# Altium schematic sheet LED.SchDoc
size A4
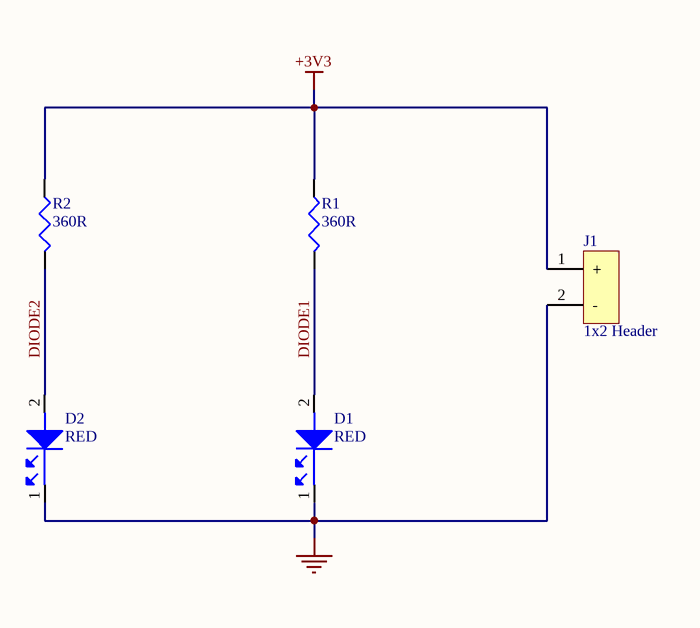
[diagram p0: LED.SchDoc]

## Parts
D1  RED  [LED0803RED]
D2  RED  [LED0803RED]
J1  1x2 Header  [HDR1X2]
R1  360R  [R0805]
R2  360R  [R0805]

## Nets
+3V3: J1.1(+) R1.1 R2.1
GND: D1.1(RED) D2.1(RED) J1.2(-)
DIODE1: D1.2 R1.2
DIODE2: D2.2 R2.2

## Library data of the parts
D1 D2 = LSL29K-G1J2-1-Z: LED Uni-Color Red 643nm Automotive 2-Pin SMD T/R; Manufacturer: Osram Opto; Lens Color: White; Lens Style: Flat,Diffused,Colorless,Rectangular; Viewing Angle: 160°; Forward Current: 20mA; Forward Voltage: 1.8V; Luminous Intensity: 4.5mcd; Test Current: 2mA; Dominant Wavelength: 630nm; Luminous Flux: 0.017lm; Number of LEDs: 1; Reverse Voltage: 12V; Lens Transparency: Diffused; Lens Size: 0.8mm; Supplier 1: Digi-Key; Supplier Part Number 1: 475-2506-1-ND; RoHS: Yes; Category: Optoelectronics; Stock 1: 32781; Pricing 1: 1=0.38000, 10=0.25000, 100=0.16700, 500=0.11552, 1000=0.09627, 2000=0.08664 (USD); Mount: Surface Mount; Case/Package: 0603; Number of Pins: 2; Color: Red; Case Code (Metric): 1608; Case Code (Imperial): 0603; Contact Plating: Tin,Matte; Min Operating Temperature: -40°C; Max Operating Temperature: 100°C; Package Quantity: 5000; Packaging: Tape and Reel; Illumination Color: Red; Length: 1.7mm; Width: 0.8mm; Height: 0.65mm; ComponentLink1URL: https://datasheet.ciiva.com/2112/00077099-0-2112844.pdf?src-supplier=Digi-Key; ComponentLink1Description: https://datasheet.ciiva.com/2112/00077099-0-2112844.pdf?src-supplier=Digi-Key; ComponentLink2URL: https://datasheet.ciiva.com/2112/00077099-0-2112845.pdf?src-supplier=Digi-Key; ComponentLink2Description: https://datasheet.ciiva.com/2112/00077099-0-2112845.pdf?src-supplier=Digi-Key; ComponentLink3URL: https://datasheet.ciiva.com/2112/00077099-0-2112846.pdf?src-supplier=Digi-Key; ComponentLink3Description: https://datasheet.ciiva.com/2112/00077099-0-2112846.pdf?src-supplier=Digi-Key; Manufacturer Part Number: LSL29K-G1J2-1-Z
J1 = 022292021: Manufacturer: Molex; Number of Circuits: 2; Supplier 1: Digi-Key; RoHS: No; Category: Connectors; Stock 1: 19377; Pricing 1: 1=0.48000, 10=0.38700, 100=0.28400, 1000=0.22593, 5000=0.19365, 10000=0.18074 (USD); Orientation: Vertical; Supplier Part Number 1: WM2744-ND; Manufacturer Part Number: 022292021; Parameter 1: *
R1 R2 = CRCW080536R0FKEA: RES, THICK FILM, 36R, 1%, 0.125W, 0805; Product Range:AEC-Q200 CRCW Series; Resistance:36ohm; Power Rating:125mW; Resistance Tolerance: 1%; Voltage Rating:150V; Resistor Case Style:0805 [2012 Metric]; Packaging:Cut Tape ;RoHS Compliant: Yes; Manufacturer: Vishay; Temperature Coefficient: 100ppm/°C; Max Power Dissipation: 125mW; Voltage Rating (DC): 150V; Supplier 1: Digi-Key; Supplier Part Number 1: 541-36.0CCT-ND; RoHS: Yes; Category: Resistors; Stock 1: 28487; Pricing 1: 1=0.10000, 10=0.06300, 100=0.02540, 1000=0.01143, 2500=0.00992 (USD); Case/Package: 0805; Number of Pins: 2; Case Code (Metric): 2012; Case Code (Imperial): 0805; Contact Plating: Tin; Weight: 0.000194oz; Min Operating Temperature: -55°C; Max Operating Temperature: 155°C; Resistance: 36R; Tolerance: 1%; Packaging: Cut Tape; Package Quantity: 5000; Resistor Type: Thick Film; Number of Terminations: 2; Features: Automotive AEC-Q200; Power Rating: 125mW; Voltage Rating: 150V; Termination: SMD/SMT; Series: D/CRCW E3; Technology: THICK FILM; Length: 2mm; Width: 1.25mm; Height: 0.45mm; Depth: 1.25mm; Lead Free: Lead Free; REACH SVHC: Unknown; Military Standard: Not; RoHS Compliant: Yes; ComponentLink1URL: https://datasheet.ciiva.com/5936/1697337-5936166.pdf?src-supplier=Farnell; ComponentLink1Description: https://datasheet.ciiva.com/5936/1697337-5936166.pdf?src-supplier=Farnell; ComponentLink2URL: https://datasheet.ciiva.com/2467/dcrcwe3-2467497.pdf?src-supplier=Digi-Key; ComponentLink2Description: https://datasheet.ciiva.com/2467/dcrcwe3-2467497.pdf?src-supplier=Digi-Key; ComponentLink3URL: https://datasheet.ciiva.com/22674/1912744-22674873.pdf?src-supplier=Element14; ComponentLink3Description: https://datasheet.ciiva.com/22674/1912744-22674873.pdf?src-supplier=Element14; ComponentLink4URL: https://datasheet.ciiva.com/2467/dcrcwe3-2467498.pdf?src-supplier=Digi-Key; ComponentLink4Description: https://datasheet.ciiva.com/2467/dcrcwe3-2467498.pdf?src-supplier=Digi-Key; ComponentLink5URL: https://datasheet.ciiva.com/22705/1697337-22705578.pdf?src-supplier=Element14; ComponentLink5Description: https://datasheet.ciiva.com/22705/1697337-22705578.pdf?src-supplier=Element14; ComponentLink6URL: https://datasheet.ciiva.com/2467/dcrcwe3-2467499.pdf?src-supplier=Digi-Key; ComponentLink6Description: https://datasheet.ciiva.com/2467/dcrcwe3-2467499.pdf?src-supplier=Digi-Key; ComponentLink7URL: https://datasheet.ciiva.com/9013/dcrcwe3-9013853.pdf?src-supplier=Avnet; ComponentLink7Description: https://datasheet.ciiva.com/9013/dcrcwe3-9013853.pdf?src-supplier=Avnet; ComponentLink8URL: https://datasheet.ciiva.com/5550/dcrcwe3-109170-5550495.pdf?src-supplier=Mouser; ComponentLink8Description: https://datasheet.ciiva.com/5550/dcrcwe3-109170-5550495.pdf?src-supplier=Mouser; ComponentLink9URL: https://datasheet.ciiva.com/26316/fld-crcw-e3-data-en-26316527.pdf?src-supplier=Distrelec; ComponentLink9Description: https://datasheet.ciiva.com/26316/fld-crcw-e3-data-en-26316527.pdf?src-supplier=Distrelec; Parameter 1: *; Manufacturer Part Number: CRCW080536R0FKEA